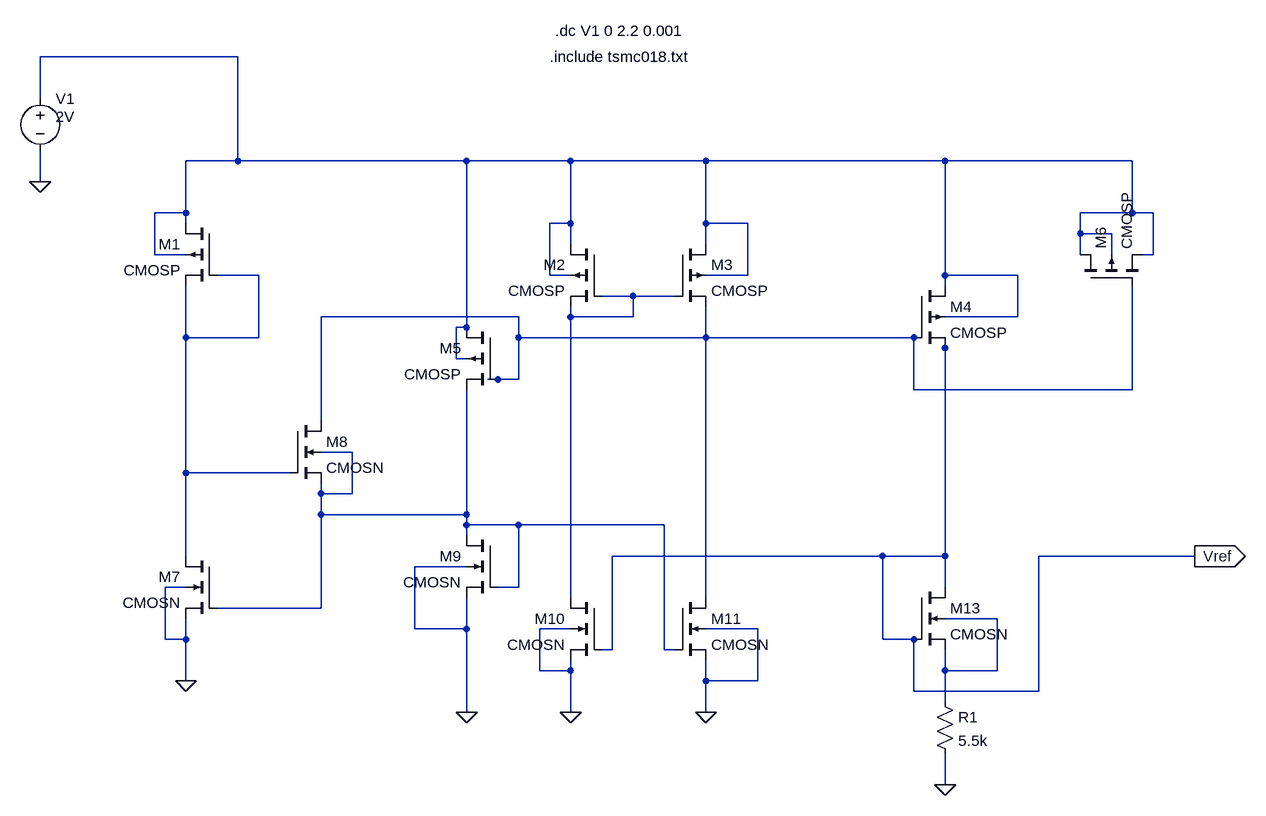
[diagram p0: schematic trg637.asc]
trg637.asc, the LTspice schematic file:
Version 4
SHEET 1 2252 680
WIRE 48 -576 -256 -576
WIRE -256 -512 -256 -576
WIRE 48 -416 48 -576
WIRE 48 -416 -32 -416
WIRE 400 -416 48 -416
WIRE 560 -416 400 -416
WIRE 768 -416 560 -416
WIRE 1136 -416 768 -416
WIRE 1424 -416 1136 -416
WIRE -256 -384 -256 -432
WIRE -32 -336 -32 -416
WIRE -32 -336 -80 -336
WIRE 1424 -336 1424 -416
WIRE 1424 -336 1344 -336
WIRE 1456 -336 1424 -336
WIRE -32 -320 -32 -336
WIRE 560 -320 560 -416
WIRE 560 -320 528 -320
WIRE 768 -320 768 -416
WIRE 832 -320 768 -320
WIRE 1344 -304 1344 -336
WIRE 1392 -304 1344 -304
WIRE 560 -288 560 -320
WIRE 768 -288 768 -320
WIRE -80 -272 -80 -336
WIRE -32 -272 -80 -272
WIRE 1344 -272 1344 -304
WIRE 1392 -272 1392 -304
WIRE 1456 -272 1456 -336
WIRE 1456 -272 1440 -272
WIRE 80 -240 16 -240
WIRE 528 -240 528 -320
WIRE 560 -240 528 -240
WIRE 832 -240 832 -320
WIRE 832 -240 768 -240
WIRE 1136 -240 1136 -416
WIRE 1248 -240 1136 -240
WIRE 1136 -224 1136 -240
WIRE 656 -208 608 -208
WIRE 720 -208 656 -208
WIRE 480 -176 176 -176
WIRE 560 -176 560 -192
WIRE 656 -176 656 -208
WIRE 656 -176 560 -176
WIRE 1248 -176 1248 -240
WIRE 1248 -176 1136 -176
WIRE 400 -160 400 -416
WIRE 400 -160 384 -160
WIRE -32 -144 -32 -224
WIRE 80 -144 80 -240
WIRE 80 -144 -32 -144
WIRE 480 -144 480 -176
WIRE 768 -144 768 -192
WIRE 768 -144 480 -144
WIRE 1088 -144 768 -144
WIRE 1136 -128 1136 -144
WIRE 384 -112 384 -160
WIRE 400 -112 384 -112
WIRE 448 -80 432 -80
WIRE 480 -80 480 -144
WIRE 480 -80 448 -80
WIRE 1088 -64 1088 -144
WIRE 1424 -64 1424 -224
WIRE 1424 -64 1088 -64
WIRE 176 -16 176 -176
WIRE 224 32 176 32
WIRE -32 64 -32 -144
WIRE 128 64 -32 64
WIRE 176 96 176 80
WIRE 224 96 224 32
WIRE 224 96 176 96
WIRE 176 128 176 96
WIRE 400 128 400 -64
WIRE 400 128 176 128
WIRE 400 144 400 128
WIRE 480 144 400 144
WIRE 704 144 480 144
WIRE 400 160 400 144
WIRE -32 192 -32 64
WIRE 1040 192 624 192
WIRE 1136 192 1136 -128
WIRE 1136 192 1040 192
WIRE 1520 192 1280 192
WIRE 400 208 320 208
WIRE -32 240 -64 240
WIRE 480 240 480 144
WIRE 480 240 448 240
WIRE 1136 240 1136 192
WIRE 560 256 560 -176
WIRE 768 256 768 -144
WIRE 176 272 176 128
WIRE 176 272 16 272
WIRE 1216 288 1136 288
WIRE 320 304 320 208
WIRE 400 304 400 256
WIRE 400 304 320 304
WIRE 560 304 512 304
WIRE 848 304 768 304
WIRE -64 320 -64 240
WIRE -32 320 -32 288
WIRE -32 320 -64 320
WIRE 1040 320 1040 192
WIRE 1088 320 1040 320
WIRE 624 336 624 192
WIRE 624 336 608 336
WIRE 704 336 704 144
WIRE 720 336 704 336
WIRE 512 368 512 304
WIRE 560 368 560 352
WIRE 560 368 512 368
WIRE 1136 368 1136 336
WIRE 1216 368 1216 288
WIRE 1216 368 1136 368
WIRE -32 384 -32 320
WIRE 768 384 768 352
WIRE 848 384 848 304
WIRE 848 384 768 384
WIRE 1088 400 1088 320
WIRE 1280 400 1280 192
WIRE 1280 400 1088 400
WIRE 1136 416 1136 368
WIRE 400 432 400 304
WIRE 560 432 560 368
WIRE 768 432 768 384
WIRE 1136 544 1136 496
FLAG -32 384 0
FLAG 560 432 0
FLAG 768 432 0
FLAG 400 432 0
FLAG -256 -384 0
FLAG 1136 544 0
FLAG 1520 192 Vref
IOPIN 1520 192 Out
SYMBOL nmos4 16 192 M0
SYMATTR InstName M7
SYMATTR Value CMOSN
SYMATTR Value2 l=400n w=2u
SYMBOL nmos4 128 -16 R0
SYMATTR InstName M8
SYMATTR Value CMOSN
SYMATTR Value2 l=400n w=4u
SYMBOL nmos4 448 160 M0
SYMATTR InstName M9
SYMATTR Value CMOSN
SYMATTR Value2 l=400n w=2u
SYMBOL nmos4 608 256 M0
SYMATTR InstName M10
SYMATTR Value CMOSN
SYMATTR Value2 l=400n w=2u
SYMBOL nmos4 720 256 R0
SYMATTR InstName M11
SYMATTR Value CMOSN
SYMATTR Value2 l=400n w=2u
SYMBOL nmos4 1088 240 R0
SYMATTR InstName M13
SYMATTR Value CMOSN
SYMATTR Value2 l=400n w=2u
SYMBOL voltage -256 -528 R0
WINDOW 3 24 44 Left 2
WINDOW 123 0 0 Left 0
WINDOW 39 0 0 Left 0
SYMATTR Value 2V
SYMATTR InstName V1
SYMBOL res 1120 400 R0
SYMATTR InstName R1
SYMATTR Value 5.5k
SYMBOL pmos4 1344 -224 R270
SYMATTR InstName M6
SYMATTR Value CMOSP
SYMATTR Value2 l=400n w=400n
SYMBOL pmos4 16 -320 M0
SYMATTR InstName M1
SYMATTR Value CMOSP
SYMATTR Value2 l=800n w=400n
SYMBOL pmos4 608 -288 M0
SYMATTR InstName M2
SYMATTR Value CMOSP
SYMATTR Value2 l=200u w=10n
SYMBOL pmos4 720 -288 R0
SYMATTR InstName M3
SYMATTR Value CMOSP
SYMATTR Value2 l=200u w=10n
SYMBOL pmos4 1088 -224 R0
SYMATTR InstName M4
SYMATTR Value CMOSP
SYMATTR Value2 l=200u w=10n
SYMBOL pmos4 448 -160 M0
SYMATTR InstName M5
SYMATTR Value CMOSP
SYMATTR Value2 l=200n w=10u
TEXT 528 -576 Left 2 !.include tsmc018.txt
TEXT 536 -616 Left 2 !.dc V1 0 2.2 0.001

The netlist it stands for:
* trg637.asc
M7 N002 N005 0 0 CMOSN l=400n w=2u
M8 N004 N002 N005 N005 CMOSN l=400n w=4u
M9 N005 N005 0 0 CMOSN l=400n w=2u
M10 N003 Vref 0 0 CMOSN l=400n w=2u
M11 N004 N005 0 0 CMOSN l=400n w=2u
M13 Vref Vref N006 N006 CMOSN l=400n w=2u
V1 N001 0 2V
R1 N006 0 5.5k
M6 N001 N004 N001 N001 CMOSP l=400n w=400n
M1 N001 N002 N002 N001 CMOSP l=800n w=400n
M2 N001 N003 N003 N001 CMOSP l=200u w=10n
M3 N001 N003 N004 N001 CMOSP l=200u w=10n
M4 N001 N004 Vref N001 CMOSP l=200u w=10n
M5 N001 N004 N005 N001 CMOSP l=200n w=10u
.model NMOS NMOS
.model PMOS PMOS
.lib standard.mos
.include tsmc018.txt
.dc V1 0 2.2 0.001
.backanno
.end